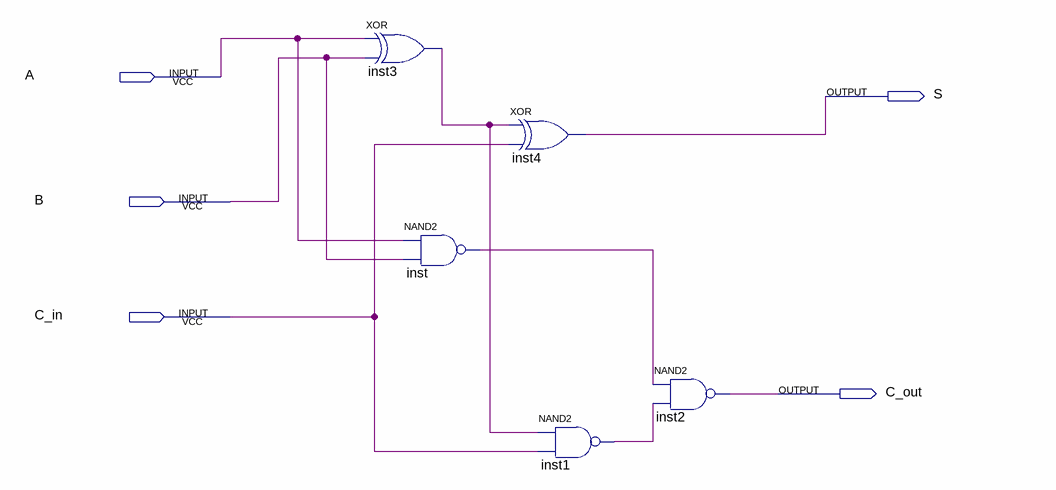
[diagram p0: schematic sheet]
// Quartus schematic adder01.bdf as structural Verilog: 5 symbols, 5 pins
module adder01 (
  input  A,
  input  B,
  input  C_in,
  output S,
  output C_out
);

  wire inst1_out, inst3_out, inst_out;

  xor inst3 (inst3_out, A, B);
  nand inst (inst_out, A, B);
  xor inst4 (S, inst3_out, C_in);
  nand inst1 (inst1_out, inst3_out, C_in);
  nand inst2 (C_out, inst_out, inst1_out);
endmodule
